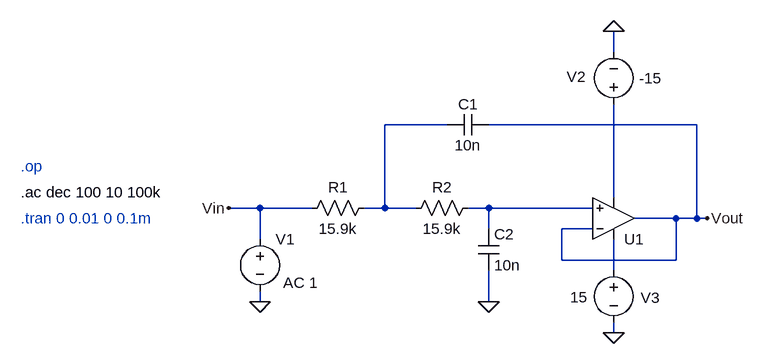
[diagram p0: schematic Active 2nd Order LPF.asc]
Active 2nd Order LPF.asc, the LTspice schematic file:
Version 4.1
SHEET 1 880 680
WIRE 416 -128 416 -160
WIRE 160 -16 64 -16
WIRE 544 -16 224 -16
WIRE 416 96 416 -48
WIRE -128 112 -176 112
WIRE -48 112 -128 112
WIRE 64 112 64 -16
WIRE 64 112 32 112
WIRE 112 112 64 112
WIRE 224 112 192 112
WIRE 384 112 224 112
WIRE 512 128 448 128
WIRE 544 128 544 -16
WIRE 544 128 512 128
WIRE 560 128 544 128
WIRE 224 144 224 112
WIRE 384 144 336 144
WIRE -128 160 -128 112
WIRE 336 192 336 144
WIRE 512 192 512 128
WIRE 512 192 336 192
WIRE 416 208 416 160
WIRE -128 256 -128 240
WIRE 224 256 224 208
WIRE 416 304 416 288
FLAG 560 128 Vout
FLAG -176 112 Vin
FLAG -128 256 0
FLAG 224 256 0
FLAG 416 304 0
FLAG 416 -160 0
SYMBOL res 48 96 R90
WINDOW 0 0 56 VBottom 2
WINDOW 3 32 56 VTop 2
SYMATTR InstName R1
SYMATTR Value 15.9k
SYMBOL res 208 96 R90
WINDOW 0 0 56 VBottom 2
WINDOW 3 32 56 VTop 2
SYMATTR InstName R2
SYMATTR Value 15.9k
SYMBOL cap 208 144 R0
SYMATTR InstName C2
SYMATTR Value 10n
SYMBOL OpAmps\\UniversalOpAmp2 416 128 M180
SYMATTR InstName U1
SYMBOL voltage -128 144 R0
WINDOW 3 28 111 Left 2
WINDOW 123 36 83 Left 2
WINDOW 39 0 0 Left 0
SYMATTR Value ""
SYMATTR Value2 AC 1
SYMATTR InstName V1
SYMBOL cap 224 -32 R90
WINDOW 0 0 32 VBottom 2
WINDOW 3 32 32 VTop 2
SYMATTR InstName C1
SYMATTR Value 10n
SYMBOL voltage 416 -32 R180
WINDOW 0 43 58 Left 2
WINDOW 3 -75 56 Left 2
WINDOW 123 0 0 Left 0
WINDOW 39 0 0 Left 0
SYMATTR InstName V2
SYMATTR Value -15
SYMBOL voltage 416 192 R0
WINDOW 0 42 58 Left 2
WINDOW 3 -67 57 Left 2
WINDOW 123 0 0 Left 0
WINDOW 39 0 0 Left 0
SYMATTR InstName V3
SYMATTR Value 15
TEXT -496 48 Left 2 ;.op
TEXT -496 88 Left 2 !.ac dec 100 10 100k
TEXT -496 128 Left 2 ;.tran 0 0.01 0 0.1m

The netlist it stands for:
* Active 2nd Order LPF.asc
R1 N001 Vin 15.9k
R2 N003 N001 15.9k
C2 N003 0 10n
X§U1 N003 Vout N004 N002 Vout level2 Avol=1Meg GBW=10Meg Slew=10Meg Ilimit=25m Rail=0 Vos=0 En=0 Enk=0 In=0 Ink=0 Rin=500Meg  ; pins In+ In- V+ V- OUT
V1 Vin 0 AC 1
C1 Vout N001 10n
V2 N002 0 -15
V3 N004 0 15
* .op
.ac dec 100 10 100k
* .tran 0 0.01 0 0.1m
.lib UniversalOpAmp2.lib
.backanno
.end